# EAGLE design module_af (EAGLE 9.3.0)

## Sheet 1 of 3
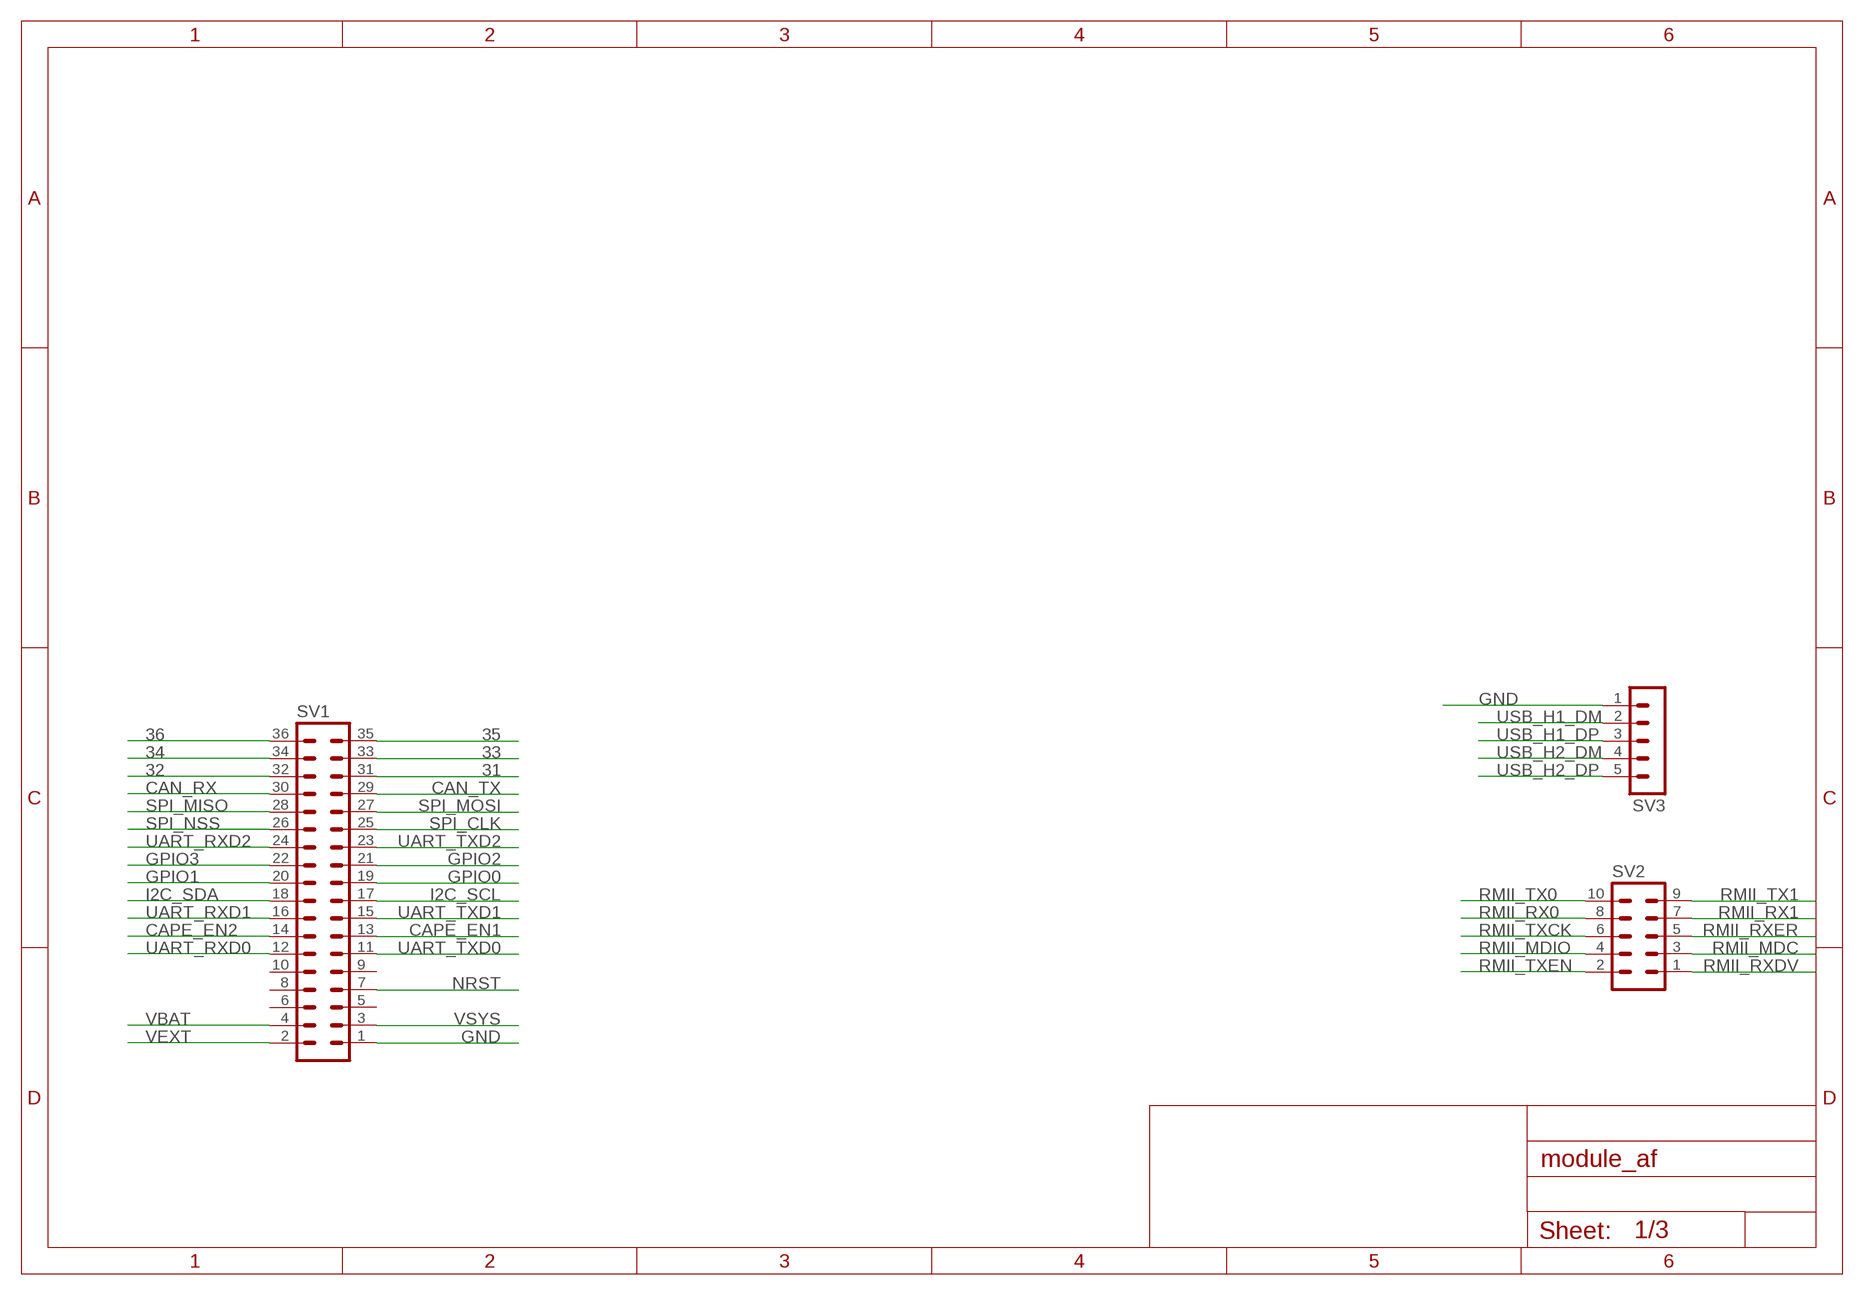
[diagram p0: schematic, sheet 1]

### Parts
SV1  MA18-2  [MA18-2]
SV2  MA05-2  [MA05-2]
SV3  MA05-1  [MA05-1]

### Nets
31: SV1.31
32: SV1.32
33: SV1.33
34: SV1.34
35: SV1.35
36: SV1.36
CAN_RX: SV1.30
CAN_TX: SV1.29
CAPE_EN1: SV1.13
CAPE_EN2: SV1.14
GND: SV1.1 SV3.1 ; also sheet 2
GPIO0: SV1.19
GPIO1: SV1.20
GPIO2: SV1.21
GPIO3: SV1.22
I2C_SCL: SV1.17
I2C_SDA: SV1.18
NRST: SV1.7
RMII_MDC: SV2.3
RMII_MDIO: SV2.4
RMII_RX0: SV2.8
RMII_RX1: SV2.7
RMII_RXDV: SV2.1
RMII_RXER: SV2.5
RMII_TX0: SV2.10
RMII_TX1: SV2.9
RMII_TXCK: SV2.6
RMII_TXEN: SV2.2
SPI_CLK: SV1.25
SPI_MISO: SV1.28
SPI_MOSI: SV1.27
SPI_NSS: SV1.26
UART_RXD0: SV1.12
UART_RXD1: SV1.16
UART_RXD2: SV1.24
UART_TXD0: SV1.11
UART_TXD1: SV1.15
UART_TXD2: SV1.23
USB_H1_DM: SV3.2
USB_H1_DP: SV3.3
USB_H2_DM: SV3.4
USB_H2_DP: SV3.5
VBAT: SV1.4
VEXT: SV1.2
VSYS: SV1.3
Unconnected: SV1.5 SV1.6 SV1.8 SV1.9 SV1.10

## Sheet 2 of 3
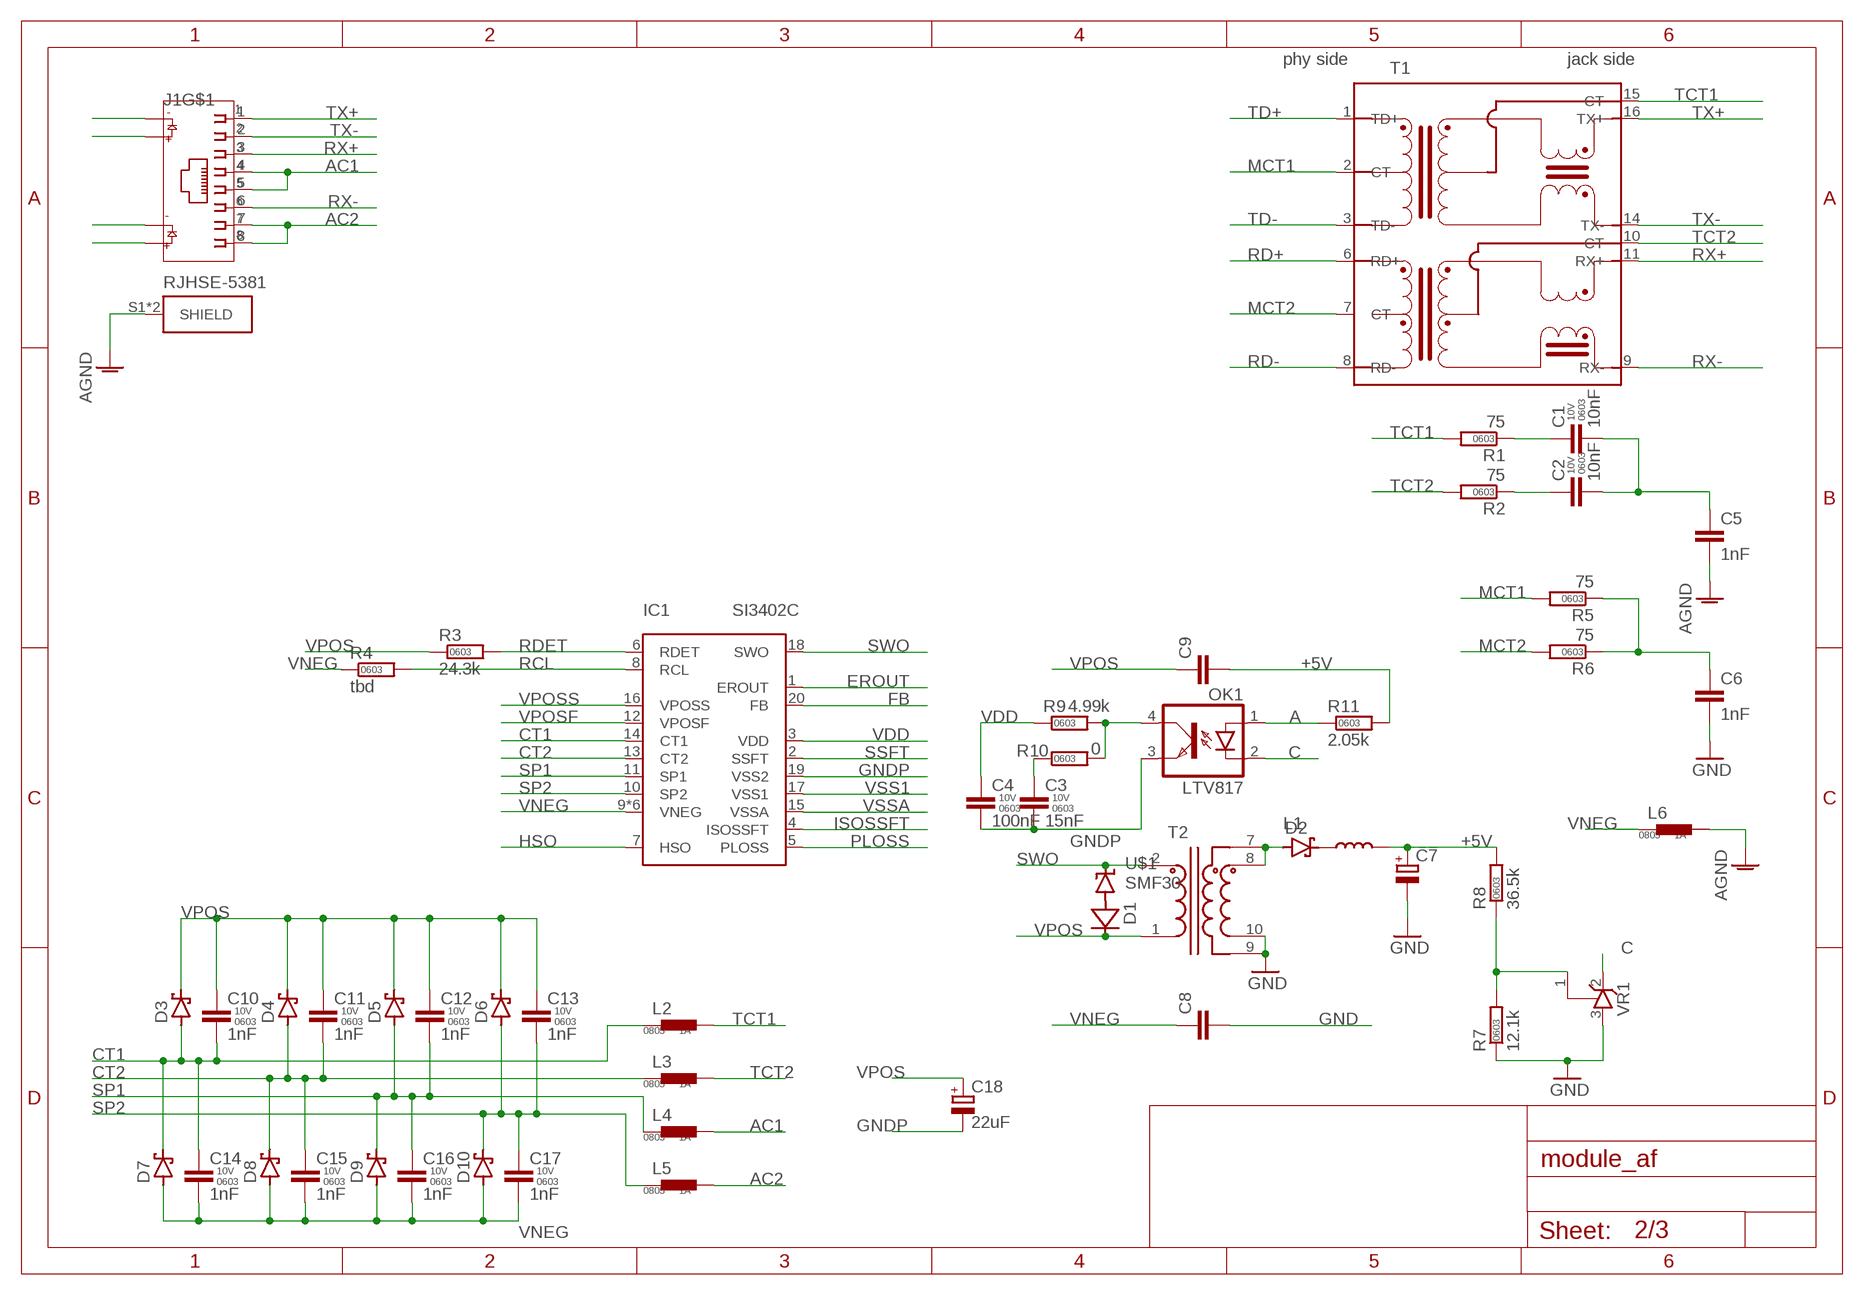
[diagram p1: schematic, sheet 2]

### Parts
C1  10nF  CAP-0603  [C0603]
C2  10nF  CAP-0603  [C0603]
C3  15nF  CAP-0603  [C0603]
C4  100nF  CAP-0603  [C0603]
C5  1nF  C-EUC1206  [C1206]
C6  1nF  C-EUC1206  [C1206]
C7  CPOL-EUE5-10.5  [E5-10,5]
C8  CAP-075-032X103  [C075-032X103]
C9  CAP-075-032X103  [C075-032X103]
C10  1nF  CAP-0603  [C0603]
C11  1nF  CAP-0603  [C0603]
C12  1nF  CAP-0603  [C0603]
C13  1nF  CAP-0603  [C0603]
C14  1nF  CAP-0603  [C0603]
C15  1nF  CAP-0603  [C0603]
C16  1nF  CAP-0603  [C0603]
C17  1nF  CAP-0603  [C0603]
C18  22uF  CPOL-EUE3.5-8  [E3,5-8]
D1  1N4148WS  [SOD323]
D2  SCHOTTKY-DIODESMC  [SMC]
D3  SK110  [DO214AC]
D4  SK110  [DO214AC]
D5  SK110  [DO214AC]
D6  SK110  [DO214AC]
D7  SK110  [DO214AC]
D8  SK110  [DO214AC]
D9  SK110  [DO214AC]
D10  SK110  [DO214AC]
IC1  SI3402-C  [QFN80P500X500X90-21T270]
J1  RJHSE-5381  [AMPHENOL_RJHSE-5381]
L1  COIL0608-0.022  [COIL0608]
L2  FER-0805  [FER0805]
L3  FER-0805  [FER0805]
L4  FER-0805  [FER0805]
L5  FER-0805  [FER0805]
L6  FER-0805  [FER0805]
OK1  LTV817  LTV816S  [DIL4-SMD]
R1  75  RES-0603  [R0603]
R2  75  RES-0603  [R0603]
R3  24.3k  RES-0603  [R0603]
R4  tbd  RES-0603  [R0603]
R5  75  RES-0603  [R0603]
R6  75  RES-0603  [R0603]
R7  12.1k  RES-0603  [R0603]
R8  36.5k  RES-0603  [R0603]
R9  4.99k  RES-0603  [R0603]
R10  0  RES-0603  [R0603]
R11  2.05k  RES-0603  [R0603]
T1  PT61017PEL  [PT61017]
T2  FA2805-CL  [FA2]
U$1  SMF30  [SODFL3718X130]
VR1  TLV431  [SOT95P240X110-3]

### Nets
+5V: C7.+ C9.2 L1.P$2 R8.2 R11.2
A: OK1.1(A) R11.1
AC1: J1.4 J1.5 L4.2
AC2: J1.7 J1.8 L5.2
AGND: C5.2 J1.S1(SHIELD) J1.S2(SHIELD) L6.2 ; also sheet 3
C: OK1.2(C) VR1.2(C)
CT1: C10.2 C14.1 D3.A D7.C IC1.14(CT1) L2.1
CT2: C11.2 C15.1 D4.A D8.C IC1.13(CT2) L3.1
EROUT: IC1.1(EROUT)
FB: IC1.20(FB)
GND: C6.2 C7.- C8.2 R7.1 T2.9 T2.10 VR1.3(A) ; also sheet 1
GNDP: C3.2 C4.2 C18.- IC1.19(VSS2) OK1.3(EMIT)
HSO: IC1.7(HSO)
ISOSSFT: IC1.4(ISOSSFT)
MCT1: R5.2 T1.2(CT)
MCT2: R6.2 T1.7(CT)
N$1: D2.C L1.P$1
N$2: C1.1 R1.1
N$3: C1.2 C2.2 C5.1
N$4: C6.1 R5.1 R6.1
N$5: C2.1 R2.1
N$6: R7.2 R8.1 VR1.1(R)
N$7: D2.A T2.7 T2.8
N$8: J1.9
N$9: D1.A U$1.A
N$10: OK1.4(COL) R9.2 R10.2
N$11: J1.11
N$12: C3.1 R10.1
N$15: J1.10
N$16: J1.12
PLOSS: IC1.5(PLOSS)
RCL: IC1.8(RCL) R4.2
RD+: T1.6(RD+)
RD-: T1.8(RD-)
RDET: IC1.6(RDET) R3.2
RX+: J1.3 T1.11(RX+)
RX-: J1.6 T1.9(RX-)
SP1: C12.2 C16.1 D5.A D9.C IC1.11(SP1) L4.1
SP2: C13.2 C17.1 D6.A D10.C IC1.10(SP2) L5.1
SSFT: IC1.2(SSFT)
SWO: IC1.18(SWO) T2.2 U$1.C
TCT1: L2.2 R1.2 T1.15(CT)
TCT2: L3.2 R2.2 T1.10(CT)
TD+: T1.1(TD+)
TD-: T1.3(TD-)
TX+: J1.1 T1.16(TX+)
TX-: J1.2 T1.14(TX-)
VDD: C4.1 IC1.3(VDD) R9.1
VNEG: C8.1 C14.2 C15.2 C16.2 C17.2 D7.A D8.A D9.A D10.A IC1.9(VNEG) IC1.21(VNEG) IC1.P$1(VNEG) IC1.P$2(VNEG) IC1.P$3(VNEG) IC1.P$4(VNEG) L6.1 R4.1
VPOS: C9.1 C10.1 C11.1 C12.1 C13.1 C18.+ D1.K(C) D3.C D4.C D5.C D6.C R3.1 T2.1
VPOSF: IC1.12(VPOSF)
VPOSS: IC1.16(VPOSS)
VSS1: IC1.17(VSS1)
VSSA: IC1.15(VSSA)

### Notes on the sheet
- phy side | jack side

## Sheet 3 of 3
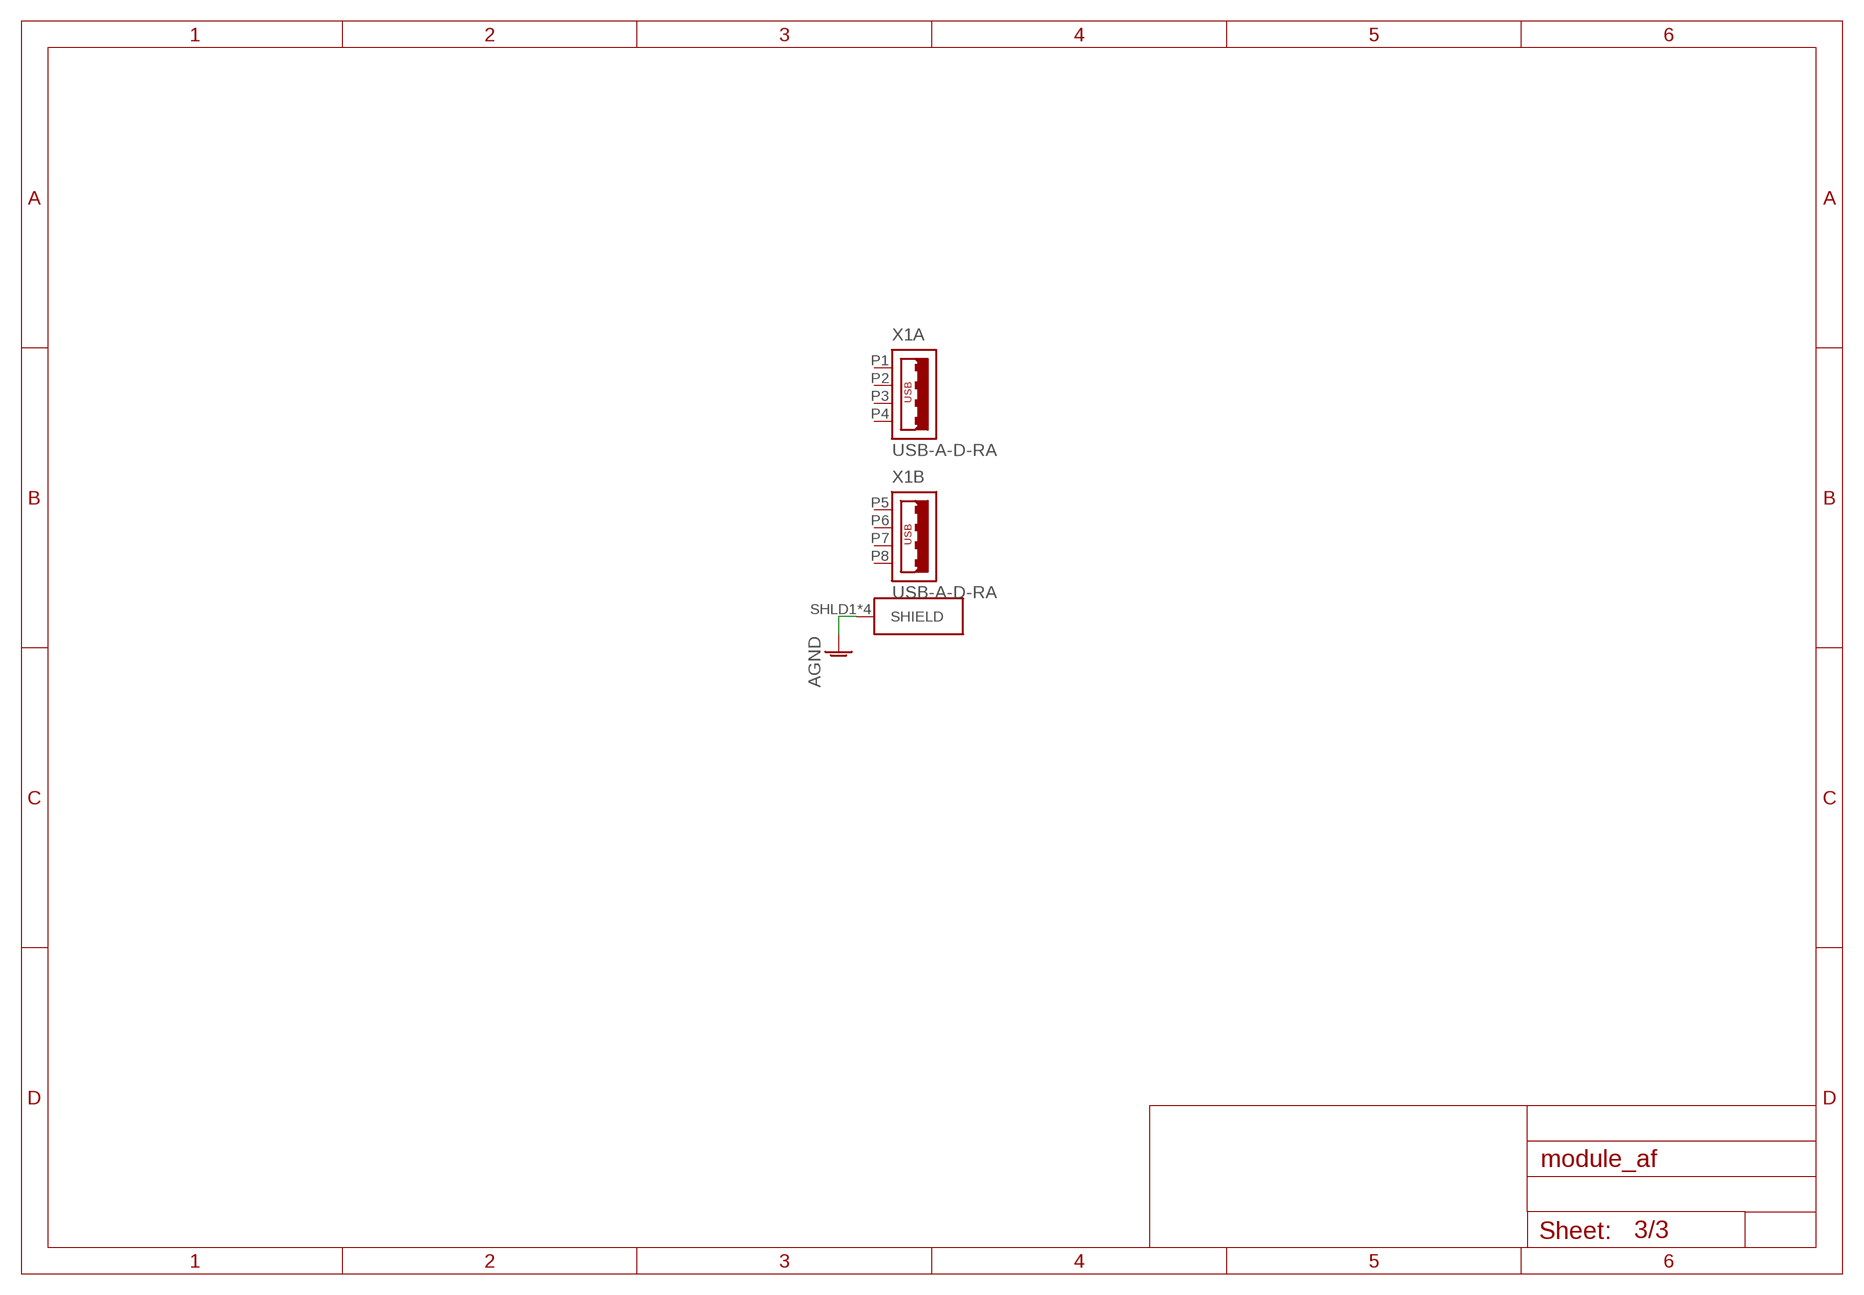
[diagram p2: schematic, sheet 3]

### Parts
X1  USB-A-D-RA  USB_2P-  [DS1096]

### Nets
AGND: X1.SHLD1(SHIELD) X1.SHLD2(SHIELD) X1.SHLD3(SHIELD) X1.SHLD4(SHIELD) ; also sheet 2
Unconnected: X1.P1 X1.P2 X1.P3 X1.P4 X1.P5 X1.P6 X1.P7 X1.P8

## Library data of the parts
C1-C4 C10-C17 = parts-passives:CAP-; PACKAGE: 0603; RATING: 10V
C5 C6 = rcl:C-EU: CAPACITOR, European symbol; SPICEPREFIX: C
C7 C18 = rcl:CPOL-EU: POLARIZED CAPACITOR, European symbol; SPICEPREFIX: C
C8 C9 = parts-passives:CAP-
D1 = parts-diotec:1N4148WS
D2 = diode:SCHOTTKY-DIODE: Schottky Diode
D3-D10 = parts-diotec:SK1
IC1 = parts-silabs:SI3402-C
J1 = parts-amphenol:RJHSE-5381: connector, mod jack, rt angle pcb, shielded, led1-g, led2-y, single port, rj-45 8 cont; AVAILABILITY: Unavailable; DESCRIPTION: connector, mod jack, rt angle pcb, shielded, led1-g, led2-y, single port, rj-45 8 cont; MF: Amphenol ICC; MP: RJHSE-5381; PACKAGE: None; PRICE: None
L1 = parts-ferrocore:COIL0608-
L2-L6 = parts-passives:FER-; CURRENT: 1A; PACKAGE: 0805
OK1 = parts-liteon:LTV816: OPTO COUPLER Source: LITEON, LTV816.pdf
R1-R11 = parts-passives:RES-; PACKAGE: 0603
SV1 = con-lstb:MA18-2: PIN HEADER; OC_FARNELL: unknown; OC_NEWARK: unknown
SV2 = con-lstb:MA05-2: PIN HEADER; OC_FARNELL: unknown; OC_NEWARK: unknown
SV3 = con-lstb:MA05-1: PIN HEADER; OC_FARNELL: unknown; OC_NEWARK: unknown
T1 = parts-bourns:PT61017PEL
T2 = parts-coilcraft:FA2
U$1 = parts-diotec:SMF
VR1 = parts-diodes:TLV431: VOLTAGE REGULATOR
X1 = parts-amphenol:USB_2P-: Dual USB Connector

## Board
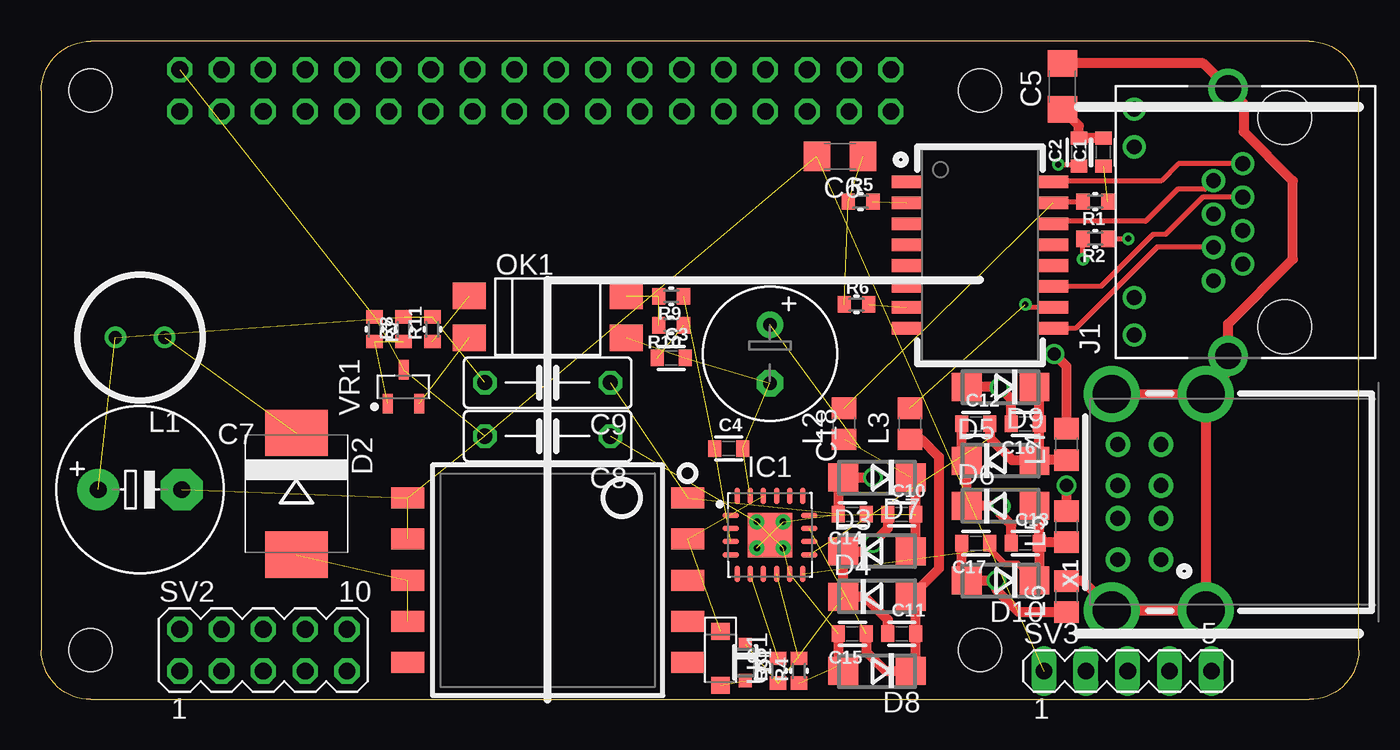
[diagram p3: board, top side]
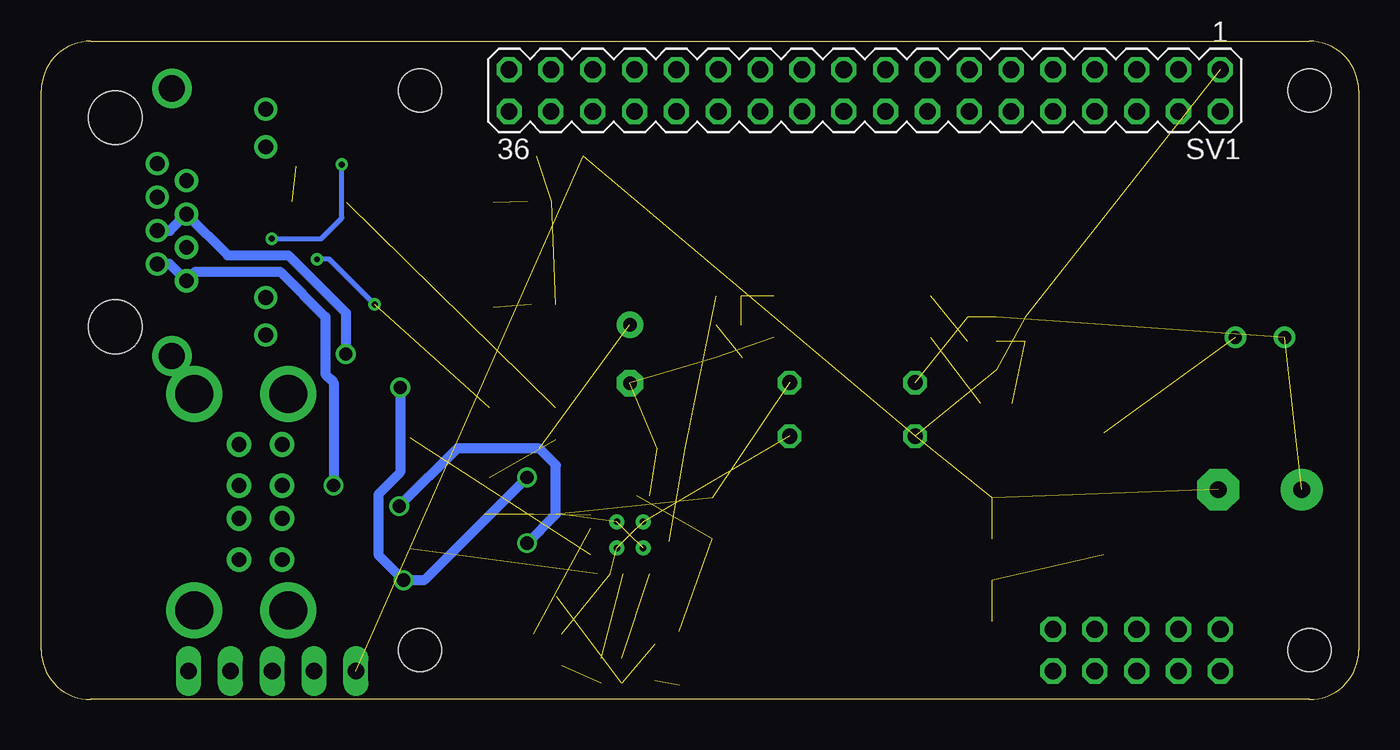
[diagram p4: board, bottom side, seen from below]

Size 80 x 40 mm. Coordinates in mm from the lower left corner, seen from the top.
Outline: 3,0 77,0 arc90 80,3 80,37 arc90 77,40 3,40 arc90 0,37 0,3 arc90 3,0
Copper layers (1*16): Top 0.035mm / dielectric 1.5mm / Bottom 0.035mm
Design rules "default *": minimum track width 6mil, minimum drill 0.35mm, track to track 6mil, track to pad 6mil, pad to pad 6mil, via to via 6mil, smd to smd 6mil, copper to edge 0.4mm, drill to drill 6mil, minimum pad ring 10mil, minimum via ring 8mil, stop-mask expansion 4mil, vias tented up to drill 0.3mm, thermal gap 10mil
Holes 2.6 mm at 3,37 3,3 57,37 57,3
tRestrict: area 0,34 to 6,40; area 0,0 to 6,6; area 54,34 to 60,40; area 54,0 to 60,6; area 74,0 to 80,6
bRestrict: area 0,34 to 6,40; area 0,0 to 6,6; area 54,34 to 60,40; area 54,0 to 60,6

### Footprints (pad centres in the part's own frame; a part is rotated, then mirrored left to right if it is on the bottom)
C0603 = smd 0.8 x 1: 1 -0.85,0; 2 0.85,0
C1206 = smd 1.6 x 1.8: 1 -1.4,0; 2 1.4,0
E5-10,5 = drill 1.016 pad 2.54: + -2.54,0 | drill 1.016 pad 2.54 octagon: - 2.54,0
C075-032X103 = drill 0.914 octagon: 1 -3.81,0; 2 3.81,0
E3,5-8 = drill 0.813 pad 1.6: + -1.778,0 | drill 0.813 pad 1.6 octagon: - 1.778,0
SOD323 = smd 0.8 x 0.8: A 1.1,0; K -1.1,0
SMC = smd 2.8 x 3.8: A 3.7,0; C -3.7,0
DO214AC = smd 1.8 x 1.7: A 2.05,0; C -2.05,0
QFN80P500X500X90-21T270 = smd 0.988 x 0.32: 1 -2.371,1.2; 2 -2.371,0.4; 3 -2.371,-0.4; 4 -2.371,-1.2; 11 2.371,-1.2; 12 2.371,-0.4; 13 2.371,0.4; 14 2.371,1.2 | smd 0.32 x 0.988: 5 -2,-2.371; 6 -1.2,-2.371; 7 -0.4,-2.371; 8 0.4,-2.371; 9 1.2,-2.371; 10 2,-2.371; 15 2,2.371; 16 1.2,2.371; 17 0.4,2.371; 18 -0.4,2.371; 19 -1.2,2.371; 20 -2,2.371 | smd 2.7 x 2.7: 21 0,0 | drill 0.4: P$1 -0.8,0.8; P$2 -0.8,-0.8; P$3 0.8,-0.8; P$4 0.8,0.8
AMPHENOL_RJHSE-5381 = drill 0.9: 1 3.55,2.54; 2 2.53,4.32; 3 1.52,2.54; 4 0.5,4.32; 5 -0.51,2.54; 6 -1.53,4.32; 7 -2.54,2.54; 8 -3.56,4.32; 9 6.86,9.14; 10 4.57,9.14; 11 -4.57,9.14; 12 -6.86,9.14 | drill 1.6: S1 8.13,3.43; S2 -8.13,3.43 | hole 3.25: 6.35,0; -6.35,0
COIL0608 = drill 0.8: P$1 -1.5,0; P$2 1.5,0
FER0805 = smd 1.3 x 1.5: 1 -0.95,0; 2 0.95,0
DIL4-SMD = smd 1.6 x 2: 1 -1.27,-4.77; 2 1.27,-4.77; 3 1.27,4.77; 4 -1.27,4.77
R0603 = smd 0.8 x 1: 1 -0.75,0; 2 0.75,0
MA18-2 = drill 1.016 octagon: 1 -21.59,-1.27; 2 -21.59,1.27; 3 -19.05,-1.27; 4 -19.05,1.27; 5 -16.51,-1.27; 6 -16.51,1.27; 7 -13.97,-1.27; 8 -13.97,1.27; 9 -11.43,-1.27; 10 -11.43,1.27; 11 -8.89,-1.27; 12 -8.89,1.27; 13 -6.35,-1.27; 14 -6.35,1.27; 15 -3.81,-1.27; 16 -3.81,1.27; 17 -1.27,-1.27; 18 -1.27,1.27; 19 1.27,-1.27; 20 1.27,1.27; 21 3.81,-1.27; 22 3.81,1.27; 23 6.35,-1.27; 24 6.35,1.27; 25 8.89,-1.27; 26 8.89,1.27; 27 11.43,-1.27; 28 11.43,1.27; 29 13.97,-1.27; 30 13.97,1.27; 31 16.51,-1.27; 32 16.51,1.27; 33 19.05,-1.27; 34 19.05,1.27; 35 21.59,-1.27; 36 21.59,1.27
MA05-2 = drill 1.016 octagon: 1 -5.08,-1.27; 2 -5.08,1.27; 3 -2.54,-1.27; 4 -2.54,1.27; 5 0,-1.27; 6 0,1.27; 7 2.54,-1.27; 8 2.54,1.27; 9 5.08,-1.27; 10 5.08,1.27
MA05-1 = drill 1.016 long: 1 -5.08,0; 2 -2.54,0; 3 0,0; 4 2.54,0; 5 5.08,0
PT61017 = smd 0.76 x 1.8: 1 -4.445,-4.45; 2 -3.175,-4.45; 3 -1.905,-4.45; 4 -0.635,-4.45; 5 0.635,-4.45; 6 1.905,-4.45; 7 3.175,-4.45; 8 4.445,-4.45; 9 4.445,4.45; 10 3.175,4.45; 11 1.905,4.45; 12 0.635,4.45; 13 -0.635,4.45; 14 -1.905,4.45; 15 -3.175,4.45; 16 -4.445,4.45
FA2 = smd 2 x 1.27: 1 -8.5,-5; 2 -8.5,-2.5; 3 -8.5,0; 4 -8.5,2.5; 5 -8.5,5; 6 8.5,5; 7 8.5,2.5; 8 8.5,0; 9 8.5,-2.5; 10 8.5,-5
SODFL3718X130 = smd 1.036 x 1.129: A 1.639,0; C -1.639,0
SOT95P240X110-3 = smd 1.18 x 0.609: 1 -1.024,0.95; 2 -1.024,-0.95; 3 1.024,0
DS1096 = drill 0.9 pad 1.5: P1 -3.5,13.01; P2 -1,13.01; P3 1,13.01; P4 3.5,13.01; P5 -3.5,15.63; P6 -1,15.63; P7 1,15.63; P8 3.5,15.63 | drill 2.3 pad 3.4: SHLD1 -6.57,16; SHLD2 -6.57,10.3; SHLD3 6.57,10.3; SHLD4 6.57,16

### Placement (x,y rotation side)
C1  64.5,33.25 90 top
C2  63,33.25 90 top
C3  38.25,20.75 0 top
C4  41.75,15.25 0 top
C5  62,37.25 90 top
C6  48.5,33 180 top
C7  6,12.75 0 top
C8  30.75,16 180 top
C9  30.75,19.25 180 top
C10  52.25,11.25 0 top
C11  52.25,4 0 top
C12  56.75,16.75 0 top
C13  59.75,9.5 0 top
C14  49.25,11.25 180 top
C15  49.25,4 180 top
C16  59.75,16.75 180 top
C17  56.75,9.5 180 top
C18  44.25,21 270 top
D1  42.75,2.25 270 top
D2  15.5,12.5 270 top
D3  50.75,9 0 top
D4  50.75,6.25 0 top
D5  58.25,14.5 0 top
D6  58.25,11.75 0 top
D7  50.75,13.5 180 top
D8  50.75,1.75 180 top
D9  58.25,19 180 top
D10  58.25,7.25 180 top
IC1  44.25,10 0 top
J1  75.5,29 90 top
L1  6,22 180 top
L2  48.75,16.75 90 top
L3  52.75,16.75 90 top
L4  62.25,15.5 90 top
L5  62.25,10.5 90 top
L6  62.25,6.25 90 top
OK1  30.75,23.25 270 top
R1  64,30.25 180 top
R2  64,28 180 top
R3  44.75,1.75 90 top
R4  46,1.75 90 top
R5  49.75,30.25 0 top
R6  49.5,24 0 top
R7  20.25,22.5 270 top
R8  22,22.5 90 top
R9  38.25,24.5 180 top
R10  38.25,22.75 180 top
R11  23.75,22.5 90 top
SV1  30,37 180 bottom
SV2  13.49,3 0 top
SV3  65.97,1.73 0 top
T1  57,27 270 top
T2  30.75,7.25 180 top
U$1  41.25,2.5 270 top
VR1  22,19 90 top
X1  81,12 90 top

### Tracks (layer width: path | path; a pad name or v marks a point on that pad's centre or on a via)
+5V  (4 unrouted)
A  (1 unrouted)
AC1  (via drill 0.8)
  Top 0.6: v61.5,21 62.25,20.25 L4.2
  Bottom 0.6: J1.5 72.19,28.49 J1.4 68.68,27 65,27 61.5,23.5 v61.5,21
AC2  (via drill 0.8)
  Top 0.6: v62.25,13 L5.2
  Bottom 0.6: J1.7 72.2,26.46 J1.8 70.62,26 65.5,26 62.75,23.25 62.75,19.75 62.25,19.25 v62.25,13
AGND
  Top 0.6: L6.2 63.23,7.2 X1.SHLD1 X1.SHLD2 X1.SHLD3 | X1.SHLD4 X1.SHLD3 | X1.SHLD3 72.07,19.94 J1.S2 72.07,22.82 76,26.75 76,31.5 73,34.5 73,36.2 J1.S1 70.55,38.65 C5.2
C  (1 unrouted)
CT1  (3 unrouted)
  Top 0.6: D3.A 53.1,9.3 C10.2 53.1,13.2 D7.C
CT2  (1 unrouted)
  Top 0.6: C15.1 50.1,2.9 51.25,1.75 D8.C 53.1,2.05 C11.2 53.1,5.95 D4.A 54.5,7.95 54.5,14.75 53.45,15.8 L3.1
GND  (8 unrouted)
GNDP  (4 unrouted)
MCT1  (1 unrouted)
MCT2  (1 unrouted)
N$1  (1 unrouted)
N$2  (1 unrouted)
N$3
  Top 0.6: C1.2 C2.2 63,34.85 C5.1
N$4  (2 unrouted)
N$5  (via drill 0.35)
  Top 0.3: R2.1 v66,28 | v61.75,32.5 62.9,32.5 C2.1
  Bottom 0.3: v66,28 63,28 61.75,29.25 v61.75,32.5
N$6  (2 unrouted)
N$7  (2 unrouted)
N$9  (1 unrouted)
N$10  (2 unrouted)
N$12  (1 unrouted)
RCL  (1 unrouted)
RDET  (1 unrouted)
RX+
  Top 0.3: J1.3 70.52,30.52 68.25,28.25 67.5,28.25 64.34,25.09 T1.11
RX-
  Top 0.3: J1.6 71.15,27.5 67.75,27.5 62.8,22.55 T1.9
SP1  (1 unrouted)
  Top 0.6: L4.1 60.35,14.55 | D5.A 60.35,14.55 | 60.35,14.55 60.6,14.8 C16.1 60.6,18.7 D9.C | C12.2 57.6,15.9 58.95,14.55 60.35,14.55
SP2  (1 unrouted)
  Top 0.4: C17.1 57.6,9.15 58.5,8.25 59.3,8.25 D10.C
  Top 0.6: L5.1 60.65,9.55 C13.2 | C13.2 60.6,11.45 D6.A | C13.2 60.6,7.55 D10.C
SWO  (2 unrouted)
TCT1  (1 unrouted)
  Top 0.3: T1.15 61.52,30.25 R1.2
TCT2  (via drill 0.35)  (1 unrouted)
  Top 0.3: T1.10 59.92,23.82 v59.75,24 | v63.25,26.75 R2.2
  Bottom 0.3: v59.75,24 62.5,26.75 v63.25,26.75
TX+
  Top 0.3: J1.1 69.05,32.55 68,31.5 61.51,31.5 T1.16
TX-
  Top 0.3: J1.2 70.65,31 69,31 67.05,29.05 61.62,29.05 61.48,28.91 T1.14
VDD  (2 unrouted)
VNEG  (via drill 0.8)  (9 unrouted)
  Top 0.6: C17.2 55.9,7.55 D10.A v58,7.25 58,6.67 59.37,5.3 L6.1 | C16.2 58.9,18.25 v58.2,18.95 58.15,19 D9.A | C15.2 48.4,2.05 D8.A | C14.2 48.4,13.2 D7.A v50.5,13.5
  Bottom 0.6: v58.2,18.95 58.2,13.8 59.5,12.5 59.5,8.75 v58,7.25 56.75,7.25 v50.5,13.5
VPOS  (via drill 0.8)  (5 unrouted)
  Top 0.6: C12.1 55.9,14.8 D5.C D6.C v58.25,11.75 58.25,11.25 58.9,10.6 C13.1 | C11.1 51.4,4.85 50,6.25 D4.C D3.C 50,9 v50.5,9.5 51.4,10.4 C10.1
  Bottom 0.6: v50.5,9.5 48.75,11.25 48.75,14.25 49.75,15.25 54.75,15.25 v58.25,11.75